# EAGLE design mcp3008-breakout (EAGLE 7.1.0)
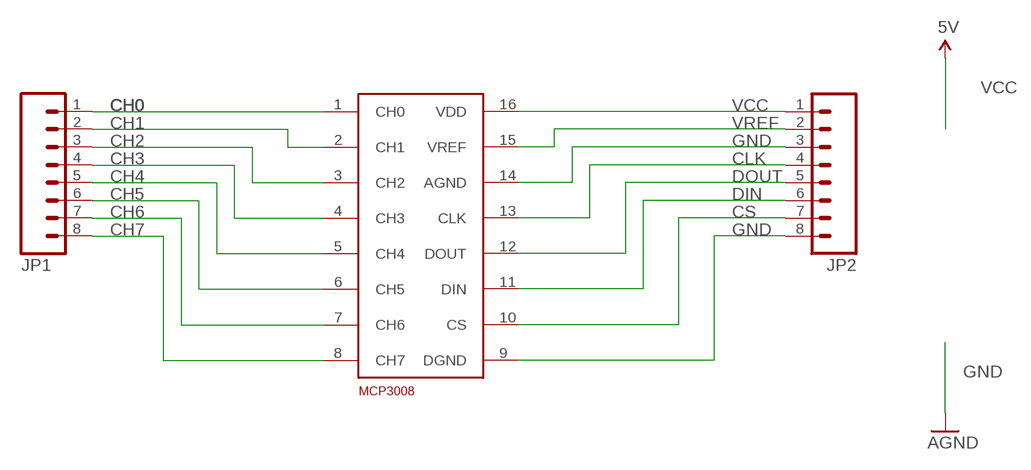
[diagram p0: schematic, sheet 1]

## Parts
JP1  M081X08  [1X08]
JP2  M081X08  [1X08]
U1  MCP3008  [SOIC16N]

## Nets
CH0: JP1.1 U1.1(CH0)
CH1: JP1.2 U1.2(CH1)
CH2: JP1.3 U1.3(CH2)
CH3: JP1.4 U1.4(CH3)
CH4: JP1.5 U1.5(CH4)
CH5: JP1.6 U1.6(CH5)
CH6: JP1.7 U1.7(CH6)
CH7: JP1.8 U1.8(CH7)
CLK: JP2.4 U1.13(CLK)
CS: JP2.7 U1.10(CS)
DIN: JP2.6 U1.11(DIN)
DOUT: JP2.5 U1.12(DOUT)
GND: JP2.3 JP2.8 U1.9(DGND) U1.14(AGND) ; supply symbol labelled AGND
VCC: JP2.1 U1.16(VDD) ; supply symbol labelled 5V
VREF: JP2.2 U1.15(VREF)

## Library data of the parts
JP1 JP2 = SparkFun-Connectors:M08: Header 8 Standard 8-pin 0.1" header. Use with straight break away headers (SKU : PRT-00116), right angle break away headers (PRT-00553), swiss pins (PRT-00743), machine pins (PRT-00117), and female headers (PRT-00115).
U1 = mcp3008-ok:MCP3008

## Board
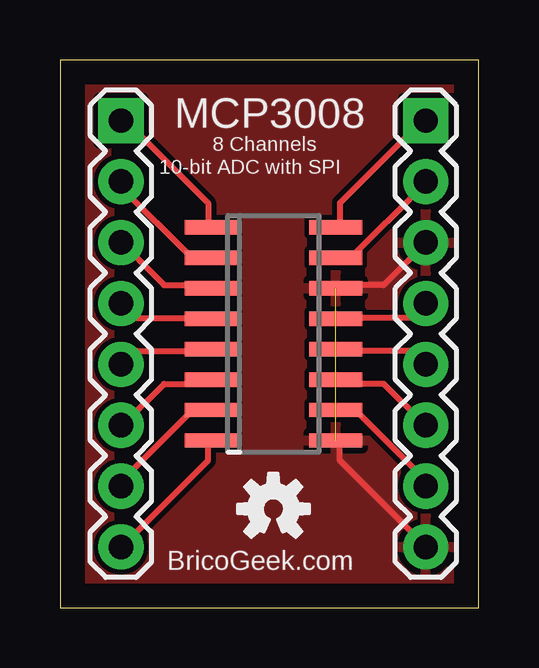
[diagram p1: board, top side]
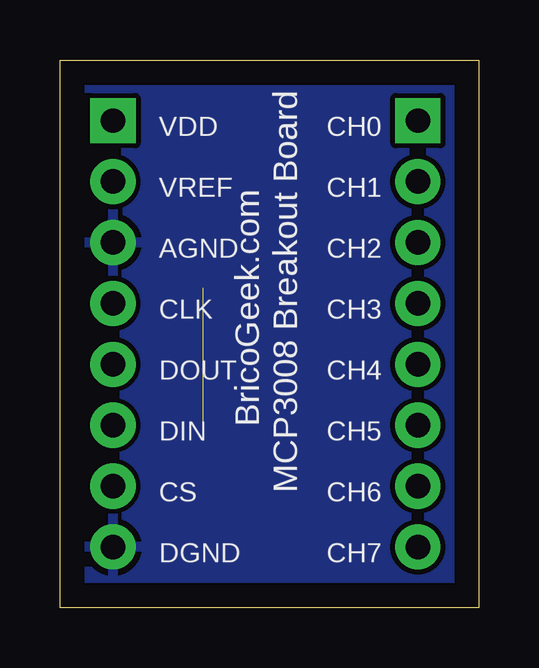
[diagram p2: board, bottom side, seen from below]

Size 17.45 x 22.85 mm. Coordinates in mm from the lower left corner, seen from the top.
Outline: 0,0 17.45,0 17.45,22.85 0,22.85 0,0
Copper layers (1*16): Top 0.035mm / dielectric 1.5mm / Bottom 0.035mm
Design rules "default": minimum track width 10mil, minimum drill 24mil, track to track 8mil, track to pad 8mil, pad to pad 8mil, via to via 8mil, smd to smd 8mil, copper to edge 40mil, drill to drill 8mil, minimum pad ring 10mil, minimum via ring 8mil, stop-mask expansion 4mil, vias tented up to drill 0mil, thermal gap 10mil

### Footprints (pad centres in the part's own frame; a part is rotated, then mirrored left to right if it is on the bottom)
1X08 = drill 1.016 pad 1.88 square: 1 0,0 | drill 1.016 pad 1.88: 2 2.54,0; 3 5.08,0; 4 7.62,0; 5 10.16,0; 6 12.7,0; 7 15.24,0; 8 17.78,0
SOIC16N = smd 0.6 x 2.2: 1 -4.445,-2.6; 2 -3.175,-2.6; 3 -1.905,-2.6; 4 -0.635,-2.6; 5 0.635,-2.6; 6 1.905,-2.6; 7 3.175,-2.6; 8 4.445,-2.6; 9 4.445,2.6; 10 3.175,2.6; 11 1.905,2.6; 12 0.635,2.6; 13 -0.635,2.6; 14 -1.905,2.6; 15 -3.175,2.6; 16 -4.445,2.6

### Placement (x,y rotation side)
JP1  2.54,20.32 270 top
JP2  15.24,20.32 270 top
U1  8.89,11.43 270 top
U$2  [OSHW-LOGO-S]  8.89,4.13 0 top

### Tracks (layer width: path | path; a pad name or v marks a point on that pad's centre or on a via)
CH0
  Top 0.254: U1.1 6.17,15.98 6.17,16.89 2.74,20.32 JP1.1
CH1
  Top 0.254: U1.2 5.49,14.61 2.52,17.58 JP1.2
CH2
  Top 0.254: U1.3 6.17,13.46 4.34,13.46 2.74,15.06 JP1.3
CH3
  Top 0.254: U1.4 6.17,12.09 3.2,12.09 2.74,12.55 JP1.4
CH4
  Top 0.254: U1.5 6.17,10.72 3.2,10.72 2.74,10.26 JP1.5
CH5
  Top 0.254: U1.6 6.17,9.35 4.34,9.35 2.74,7.75 JP1.6
CH6
  Top 0.254: U1.7 6.17,8.2 5.49,8.2 2.52,5.23 JP1.7
CH7
  Top 0.254: U1.8 6.17,6.83 6.17,6.15 2.74,2.72 JP1.8
CLK
  Top 0.254: JP2.4 14.63,12.09 11.66,12.09 U1.13
CS
  Top 0.254: U1.10 11.66,8.2 12.34,8.2 15.32,5.23 JP2.7
DIN
  Top 0.254: U1.11 11.66,9.35 13.49,9.35 15.09,7.75 JP2.6
DOUT
  Top 0.254: U1.12 11.66,10.72 14.63,10.72 15.09,10.26 JP2.5
GND  (1 unrouted)
  Top 0.254: U1.9 11.66,6.83 11.66,6.15 15.09,2.72 JP2.8 | U1.14 11.66,13.46 13.49,13.46 15.09,15.06 JP2.3
  pour Bottom: 0,22.86 17.78,22.86 17.78,0 0,0
  pour Top: 0,22.86 17.78,22.86 17.78,0 0,0
VCC
  Top 0.254: U1.16 11.66,15.98 11.66,16.89 15.09,20.32 JP2.1
VREF
  Top 0.254: U1.15 12.12,14.61 15.09,17.58 JP2.2

### Text on the board
tPlace: MCP3008 | 8 Channels | 10-bit ADC with SPI | BricoGeek.com
bPlace: MCP3008 Breakout Board | CH0 | VDD | CH1 | BricoGeek.com | VREF | CH2 | AGND | CH3 | CLK | CH4 | DOUT | CH5 | DIN | CH6 | CS | CH7 | DGND